# EAGLE design FLC-148 - Poti FFC (EAGLE 9.4.0)
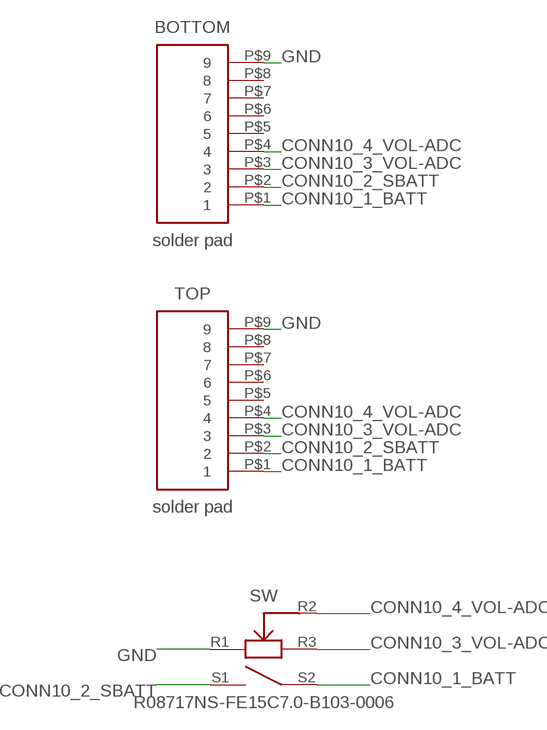
[diagram p0: schematic, sheet 1]

## Parts
BOTTOM  solder pad  FFC_END-9P_1MM_PITCH  [SMD]
SW  R08717NS-FE15C7.0-B103-0006  [TH]
TOP  solder pad  FFC_END-9P_1MM_PITCH  [SMD]

## Nets
CONN10_1_BATT [Vcc]: BOTTOM.P$1 SW.S2 TOP.P$1
CONN10_2_SBATT [Vcc]: BOTTOM.P$2 SW.S1 TOP.P$2
CONN10_3_VOL-ADC [signal]: BOTTOM.P$3 SW.R3 TOP.P$3
CONN10_4_VOL-ADC [signal]: BOTTOM.P$4 SW.R2 TOP.P$4
GND: BOTTOM.P$9 SW.R1 TOP.P$9
Unconnected: BOTTOM.P$5 BOTTOM.P$6 BOTTOM.P$7 BOTTOM.P$8 TOP.P$5 TOP.P$6 TOP.P$7 TOP.P$8

## Library data of the parts
BOTTOM TOP = FFC end 9P 1mm pitch:FFC_END-9P_1MM_PITCH
SW = R08717NS-FE15C7.0-B103-0006:R08717NS-FE15C7.0-B103-0006

## Net classes
0 GND: width 0.7 mm, clearance 0.3 mm
1 Vcc: width 0.7 mm, clearance 0.3 mm
2 signal: width 0.3 mm, clearance 0.3 mm

## Board
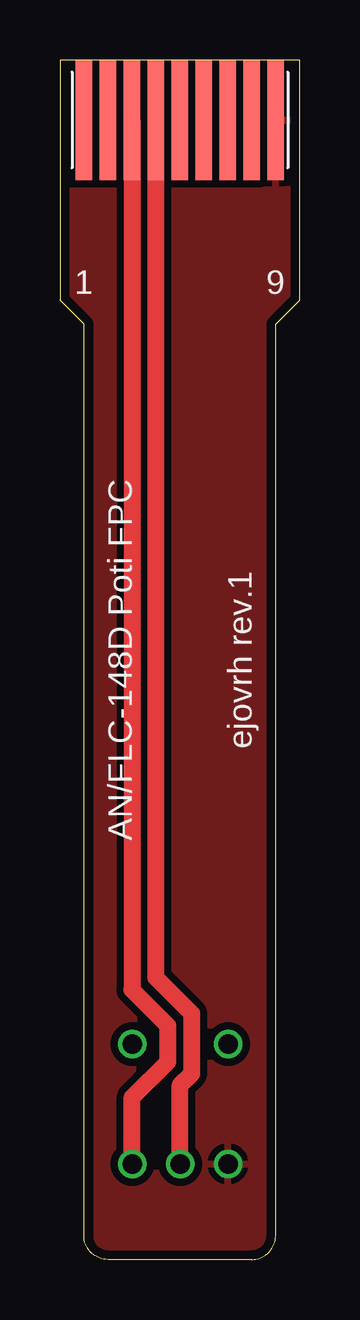
[diagram p1: board, top side]
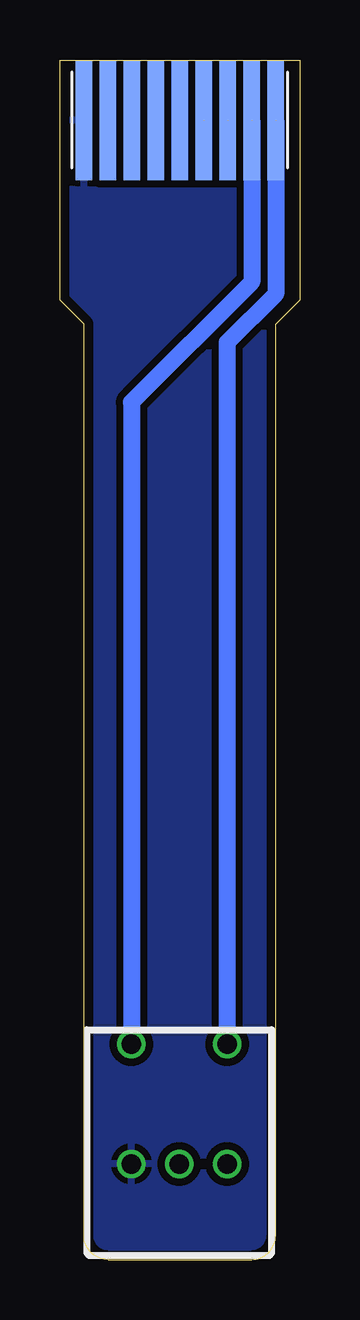
[diagram p2: board, bottom side, seen from below]

Size 10 x 50 mm. Coordinates in mm from the lower left corner, seen from the top.
Outline: 8,0 2,0 arc-90 1,1 1,39 0,40 0,50 10,50 10,40 9,39 9,1 arc-90 8,0
Copper layers (1*16): Top 0.035559375mm / dielectric 1.6mm / Bottom 0.035559375mm
Design rules "oshpark-2layer": minimum track width 6mil, minimum drill 10mil, track to track 6mil, track to pad 6mil, pad to pad 6mil, via to via 6mil, smd to smd 6mil, copper to edge 15mil, drill to drill 6mil, minimum pad ring 5mil, minimum via ring 5mil, stop-mask expansion 2.5mil, vias tented up to drill 0mil, thermal gap 10mil

### Footprints (pad centres in the part's own frame; a part is rotated, then mirrored left to right if it is on the bottom)
SMD = smd 0.7 x 5: P$1 -4,0; P$2 -3,0; P$3 -2,0; P$4 -1,0; P$5 0,0; P$6 1,0; P$7 2,0; P$8 3,0; P$9 4,0
TH = drill 0.8: R1 -2,0; R2 0,0; R3 2,0; S1 -2,5; S2 2,5

### Placement (x,y rotation side)
BOTTOM  5,47.5 180 bottom
SW  5.02,3.98 0 bottom
TOP  5,47.5 0 top

### Tracks (layer width: path | path; a pad name or v marks a point on that pad's centre or on a via)
CONN10_1_BATT  (1 unrouted)
  Bottom 0.7: SW.S2 3.02,38.23 1,40.25 BOTTOM.P$1
CONN10_2_SBATT  (1 unrouted)
  Bottom 0.7: BOTTOM.P$2 2,40.75 7.02,35.73 SW.S1
CONN10_3_VOL-ADC  (1 unrouted)
  Top 0.7: SW.R3 3.02,6.77 4.5,8.25 4.5,9.75 3,11.25 BOTTOM.P$3
CONN10_4_VOL-ADC  (1 unrouted)
  Top 0.7: SW.R2 5.02,7.27 5.5,7.75 5.5,10.25 4,11.75 BOTTOM.P$4
GND
  pour Top: -3,53 -3,-2 14,-2 14,53
  pour Bottom: -5,-3 16,-3 16,54 -5,54

### Text on the board
tPlace: 1 | 9 | AN/FLC-148D Poti FPC | ejovrh rev.1